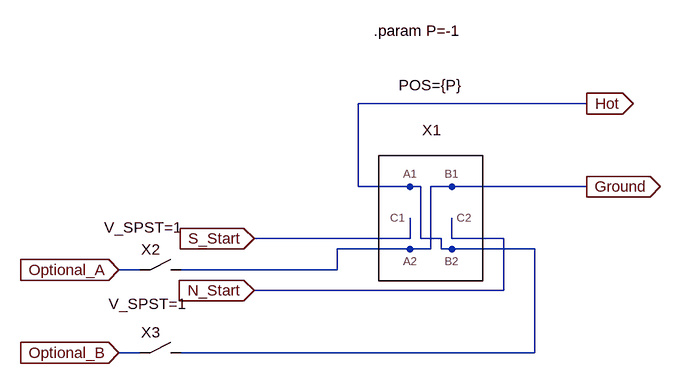
[diagram p0: schematic OutOfPhase_DPDT.asc]
OutOfPhase_DPDT.asc, the LTspice schematic file:
Version 4
SHEET 1 1860 680
WIRE 720 -528 368 -528
WIRE 368 -400 368 -528
WIRE 448 -400 368 -400
WIRE 464 -400 448 -400
WIRE 512 -400 480 -400
WIRE 720 -400 512 -400
WIRE 448 -320 448 -352
WIRE 448 -320 208 -320
WIRE 464 -320 464 -400
WIRE 496 -320 464 -320
WIRE 512 -320 512 -352
WIRE 592 -320 512 -320
WIRE 448 -304 336 -304
WIRE 480 -304 480 -400
WIRE 480 -304 448 -304
WIRE 496 -304 496 -320
WIRE 512 -304 496 -304
WIRE 640 -304 512 -304
WIRE 32 -272 0 -272
WIRE 336 -272 336 -304
WIRE 336 -272 96 -272
WIRE 592 -240 592 -320
WIRE 592 -240 208 -240
WIRE 32 -144 0 -144
WIRE 640 -144 640 -304
WIRE 640 -144 96 -144
FLAG 720 -528 Hot
IOPIN 720 -528 Out
FLAG 720 -400 Ground
IOPIN 720 -400 Out
FLAG 208 -240 N_Start
IOPIN 208 -240 In
FLAG 208 -320 S_Start
IOPIN 208 -320 In
FLAG 0 -272 Optional_A
IOPIN 0 -272 In
FLAG 0 -144 Optional_B
IOPIN 0 -144 In
SYMBOL 2pdt_onon 480 -352 R0
WINDOW 39 -1 -189 Bottom 2
SYMATTR InstName X1
SYMATTR SpiceLine POS={P}
SYMBOL 1PST 64 -272 R0
WINDOW 39 -27 -50 Bottom 2
SYMATTR InstName X2
SYMATTR SpiceLine V_SPST=1
SYMBOL 1PST 64 -144 R0
WINDOW 39 -20 -60 Bottom 2
SYMATTR InstName X3
SYMATTR SpiceLine V_SPST=1
TEXT 392 -640 Left 2 !.param P=-1

The netlist it stands for:
* OutOfPhase_DPDT.asc
XX1 Hot S_Start Ground Ground N_Start Hot 2pdt_onon POS={P}  ; pins A1 C1 A2 B1 C2 B2
XX2 Optional_A Ground 1PST V_SPST=1  ; pins In Out
XX3 Optional_B Hot 1PST V_SPST=1  ; pins In Out
.param P=-1
.backanno
.end